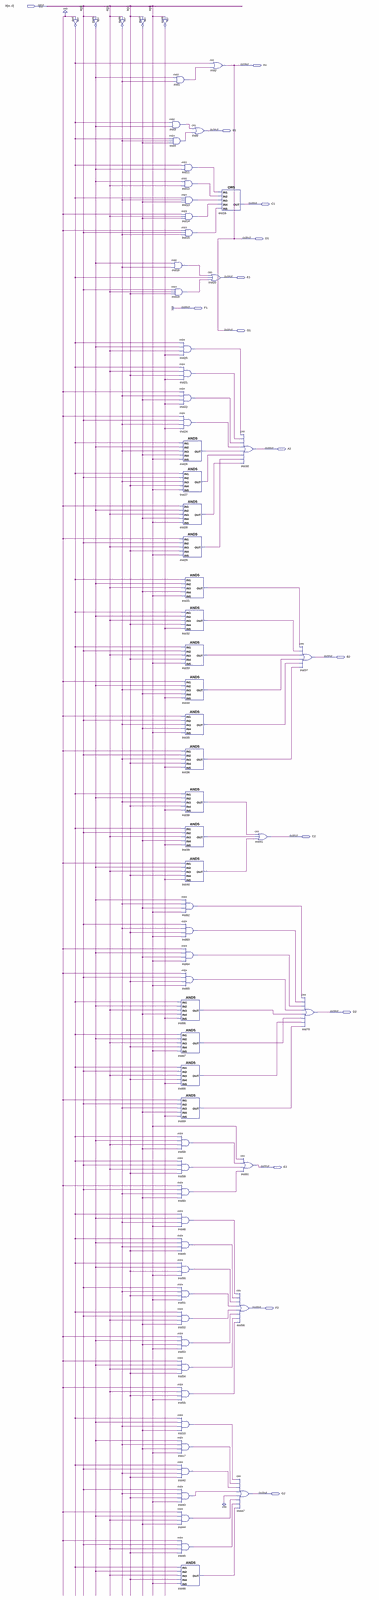
[diagram p0: schematic sheet, whole]
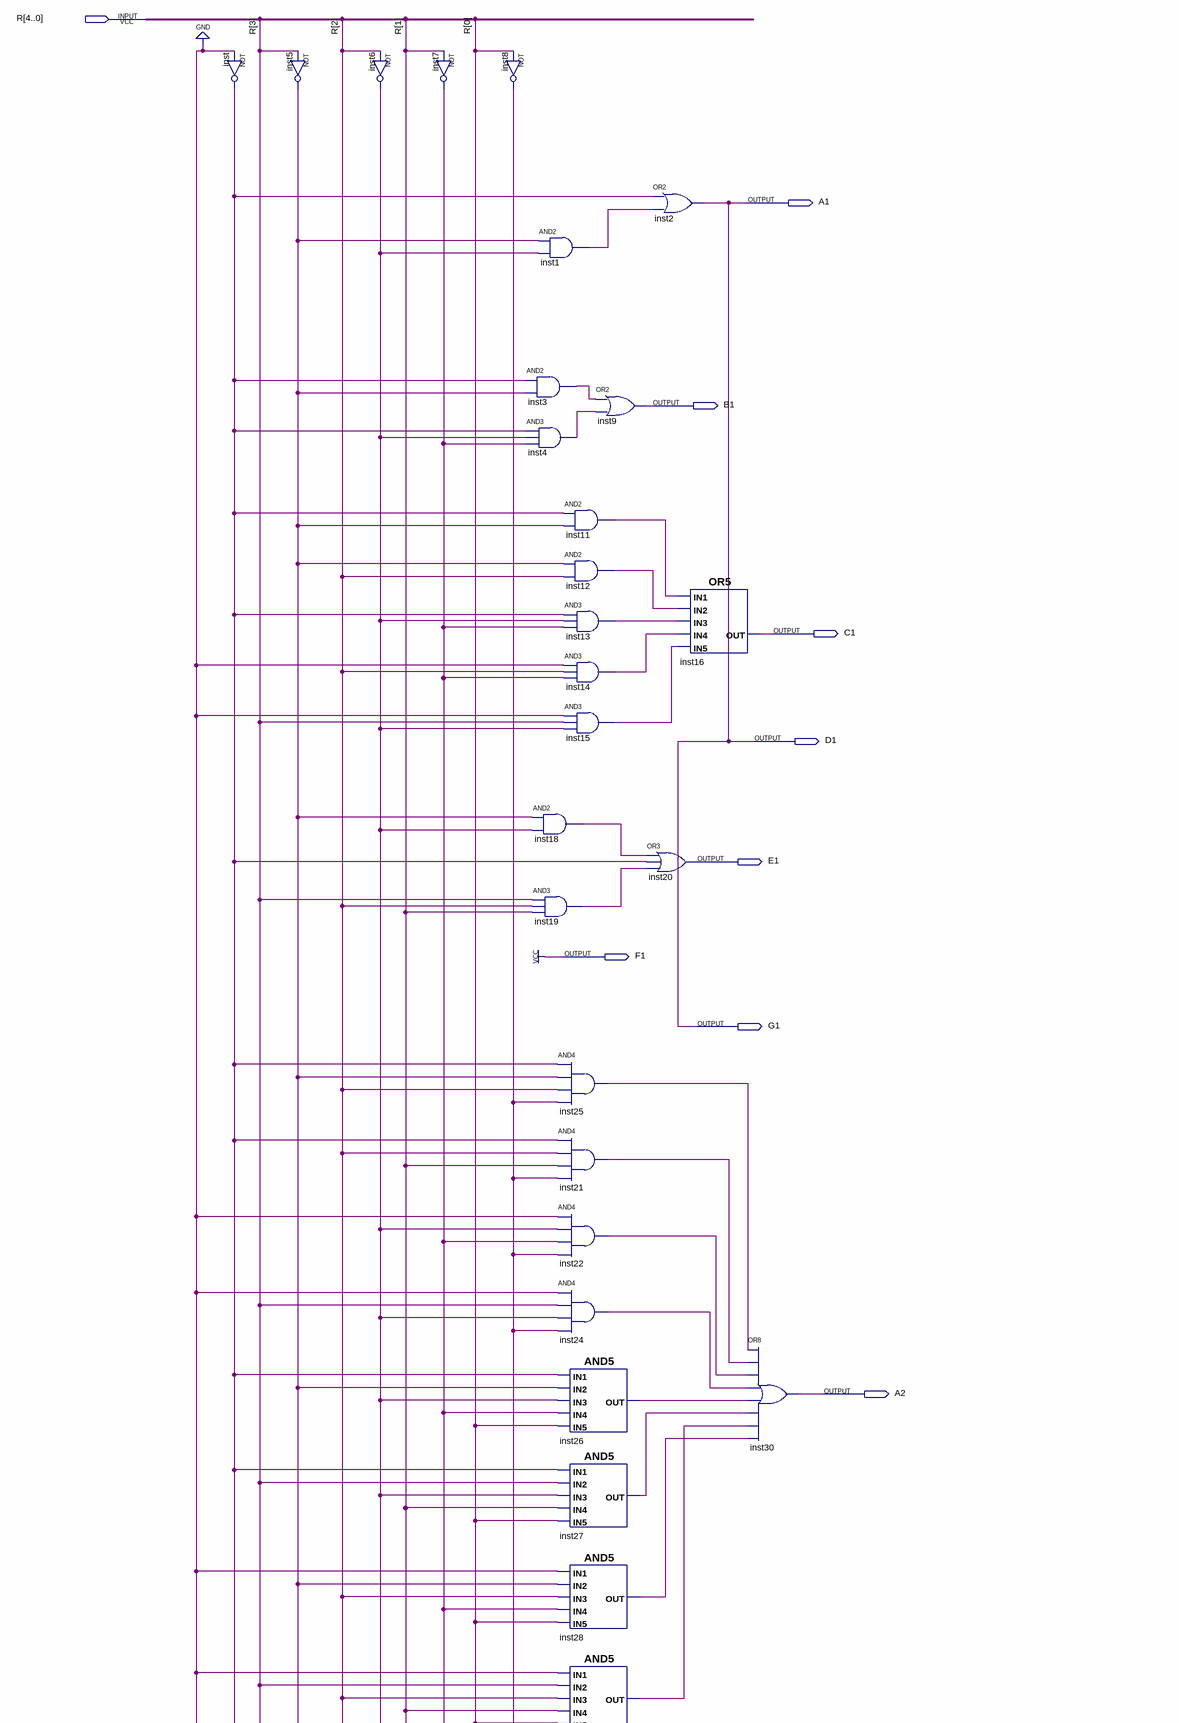
[diagram p1: schematic sheet, upper part]
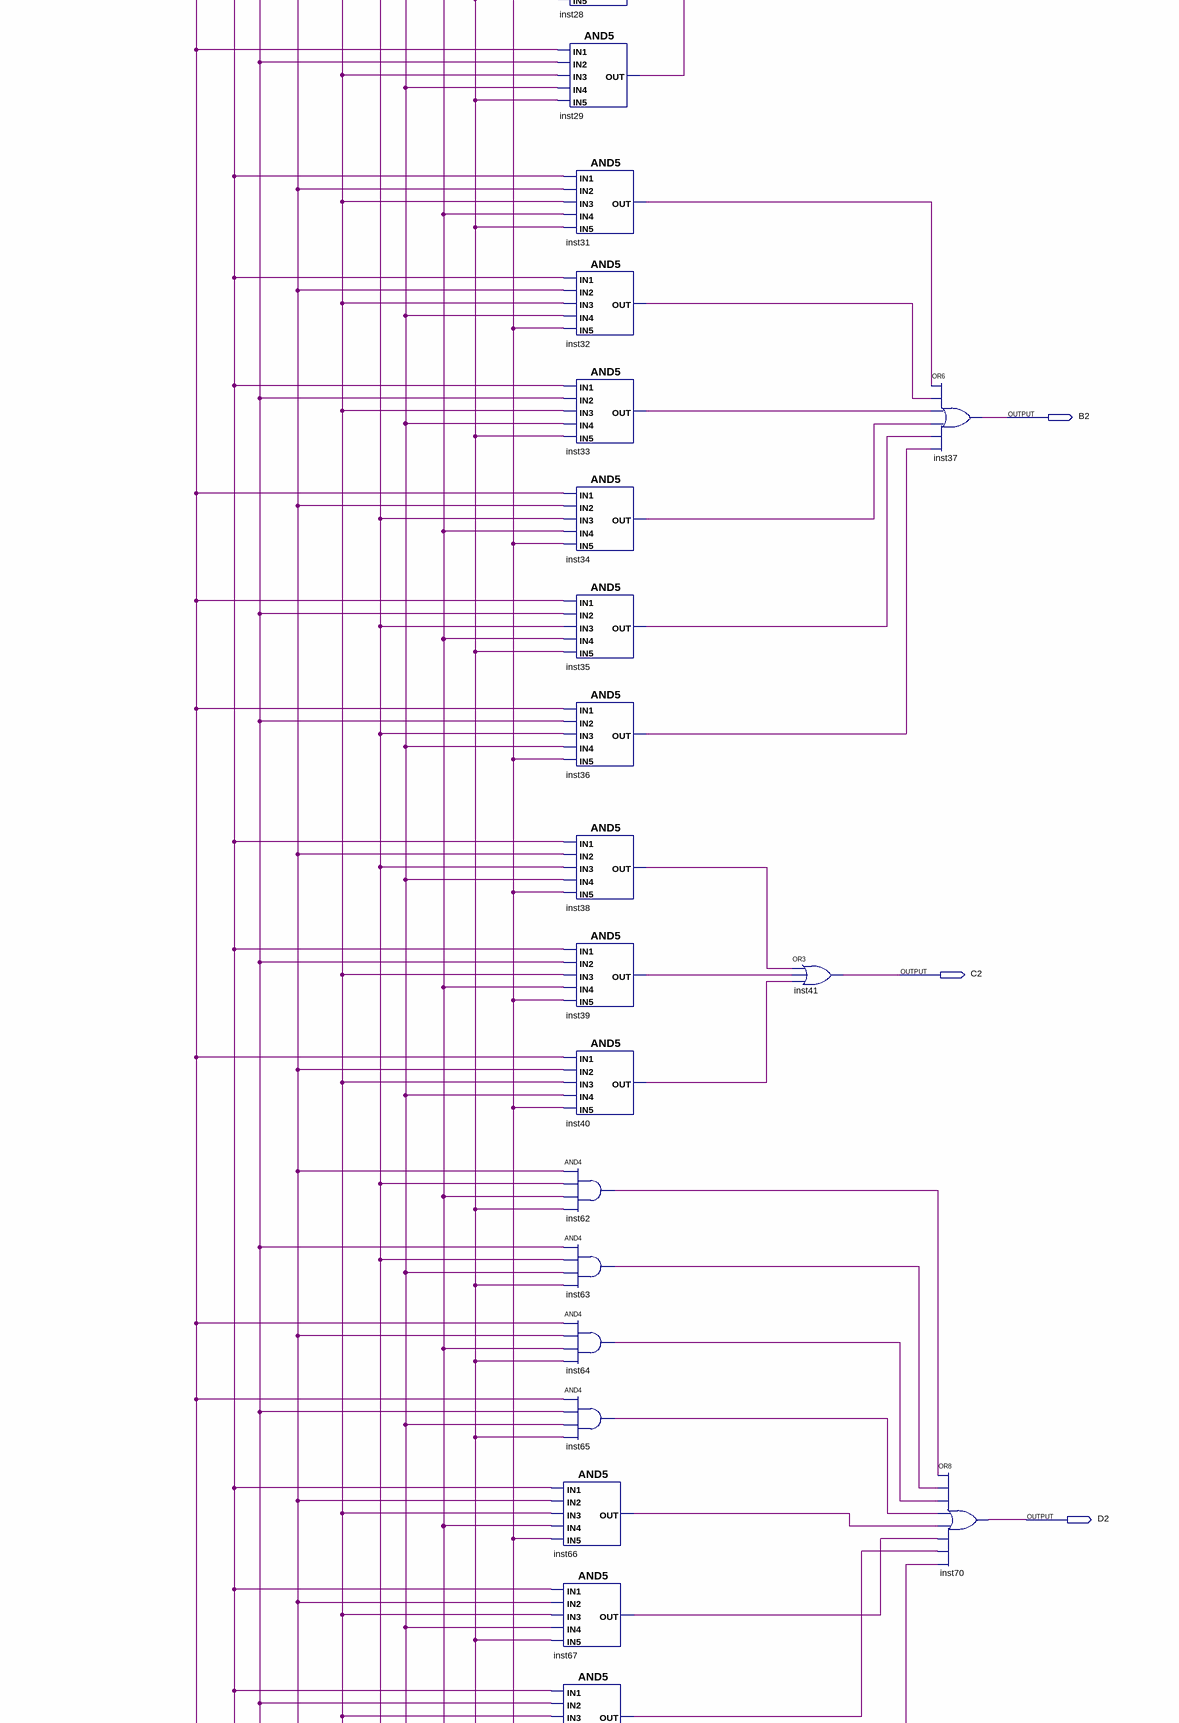
[diagram p2: schematic sheet, middle part]
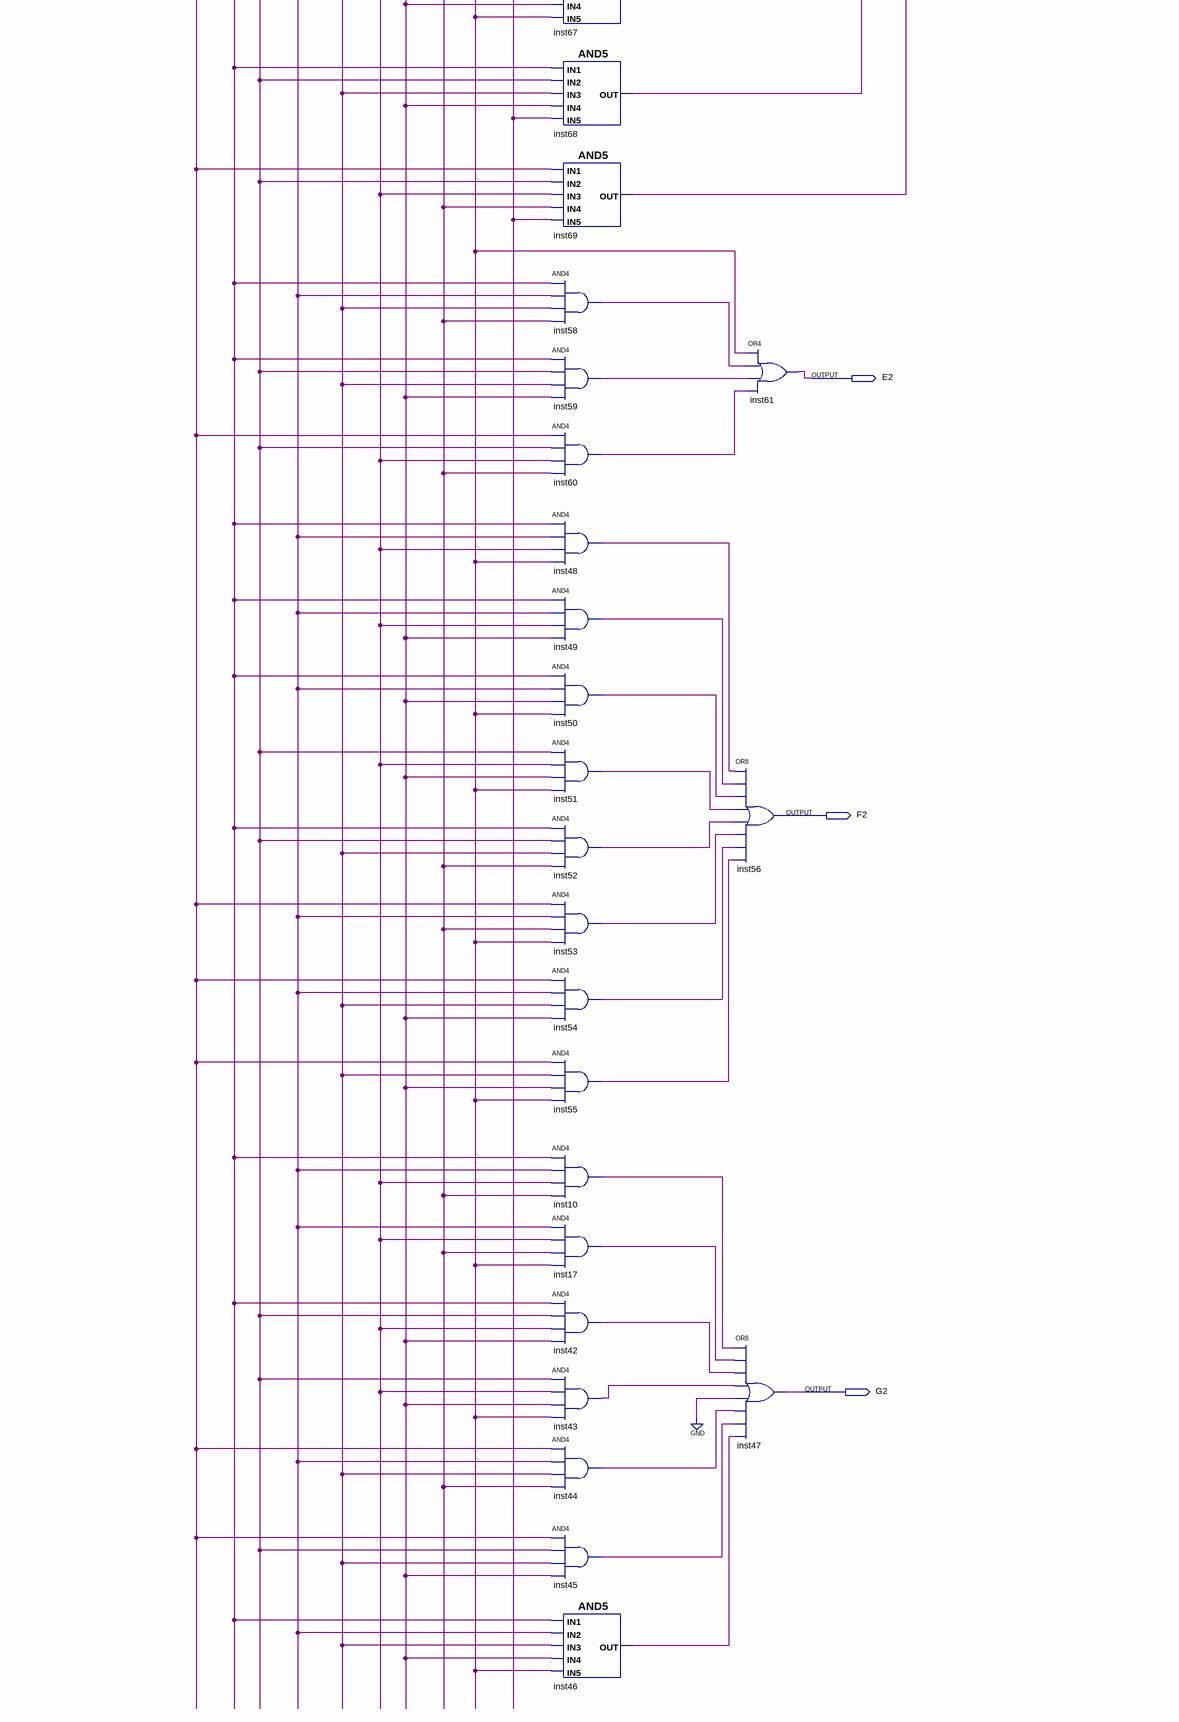
[diagram p3: schematic sheet, lower part]
// Quartus schematic DecodificadorEntrada.bdf as structural Verilog: 69 symbols, 15 pins
module DecodificadorEntrada (
  input  [4:0] R,
  output A1,
  output B1,
  output C1,
  output D1,
  output E1,
  output F1,
  output G1,
  output A2,
  output B2,
  output C2,
  output D2,
  output E2,
  output F2,
  output G2
);

  wire inst1_out, inst3_out, inst4_out, inst5_out, inst6_out, inst7_out, inst8_out, inst10_out, inst11_out,
       inst12_out, inst13_out, inst14_out, inst15_out, inst17_out, inst18_out, inst19_out, inst21_out,
       inst22_out, inst24_out, inst25_out, inst26_out, inst27_out, inst28_out, inst29_out, inst31_out,
       inst32_out, inst33_out, inst34_out, inst35_out, inst36_out, inst38_out, inst39_out, inst40_out,
       inst42_out, inst43_out, inst44_out, inst45_out, inst46_out, inst48_out, inst49_out, inst50_out,
       inst51_out, inst52_out, inst53_out, inst54_out, inst55_out, inst58_out, inst59_out, inst60_out,
       inst62_out, inst63_out, inst64_out, inst65_out, inst66_out, inst67_out, inst68_out, inst69_out,
       inst_out;

  not inst (inst_out, 1'b0);
  not inst5 (inst5_out, R[3]);
  not inst6 (inst6_out, R[2]);
  not inst7 (inst7_out, R[1]);
  not inst8 (inst8_out, R[0]);
  and inst1 (inst1_out, inst5_out, inst6_out);
  and inst3 (inst3_out, inst_out, inst5_out);
  and inst4 (inst4_out, inst_out, inst6_out, inst7_out);
  and inst18 (inst18_out, inst5_out, inst6_out);
  and inst19 (inst19_out, R[3], R[2], R[1]);
  and inst25 (inst25_out, inst_out, inst5_out, R[2], inst8_out);
  and inst21 (inst21_out, inst_out, R[2], R[1], inst8_out);
  and inst22 (inst22_out, 1'b0, inst6_out, inst7_out, inst8_out);
  and inst24 (inst24_out, 1'b0, R[3], inst6_out, inst8_out);
  and inst26 (inst26_out, inst_out, inst5_out, inst6_out, inst7_out, R[0]);
  and inst27 (inst27_out, inst_out, R[3], inst6_out, R[1], R[0]);
  and inst28 (inst28_out, 1'b0, inst5_out, R[2], inst7_out, R[0]);
  and inst29 (inst29_out, 1'b0, R[3], R[2], R[1], R[0]);
  and inst66 (inst66_out, inst_out, inst5_out, R[2], inst7_out, inst8_out);
  and inst67 (inst67_out, inst_out, inst5_out, R[2], R[1], R[0]);
  and inst68 (inst68_out, inst_out, R[3], R[2], R[1], inst8_out);
  and inst69 (inst69_out, 1'b0, R[3], inst6_out, inst7_out, inst8_out);
  and inst58 (inst58_out, inst_out, inst5_out, R[2], inst7_out);
  and inst59 (inst59_out, inst_out, R[3], R[2], R[1]);
  and inst60 (inst60_out, 1'b0, R[3], inst6_out, inst7_out);
  and inst48 (inst48_out, inst_out, inst5_out, inst6_out, R[0]);
  and inst49 (inst49_out, inst_out, inst5_out, inst6_out, R[1]);
  and inst50 (inst50_out, inst_out, inst5_out, R[1], R[0]);
  and inst51 (inst51_out, R[3], inst6_out, R[1], R[0]);
  and inst52 (inst52_out, inst_out, R[3], R[2], inst7_out);
  and inst53 (inst53_out, 1'b0, inst5_out, inst7_out, R[0]);
  and inst54 (inst54_out, 1'b0, inst5_out, R[2], R[1]);
  and inst55 (inst55_out, 1'b0, R[2], R[1], R[0]);
  and inst10 (inst10_out, inst_out, inst5_out, inst6_out, inst7_out);
  and inst17 (inst17_out, inst5_out, inst6_out, inst7_out, R[0]);
  and inst42 (inst42_out, inst_out, R[3], inst6_out, R[1]);
  and inst43 (inst43_out, R[3], inst6_out, R[1], R[0]);
  and inst44 (inst44_out, 1'b0, inst5_out, R[2], inst7_out);
  and inst45 (inst45_out, 1'b0, R[3], R[2], R[1]);
  and inst46 (inst46_out, inst_out, inst5_out, R[2], R[1], R[0]);
  or inst9 (B1, inst3_out, inst4_out);
  and inst11 (inst11_out, inst_out, inst5_out);
  and inst12 (inst12_out, inst5_out, R[2]);
  and inst13 (inst13_out, inst_out, inst6_out, inst7_out);
  and inst14 (inst14_out, 1'b0, R[2], inst7_out);
  and inst15 (inst15_out, 1'b0, R[3], inst6_out);
  and inst31 (inst31_out, inst_out, inst5_out, R[2], inst7_out, R[0]);
  and inst32 (inst32_out, inst_out, inst5_out, R[2], R[1], inst8_out);
  and inst33 (inst33_out, inst_out, R[3], R[2], R[1], R[0]);
  and inst34 (inst34_out, 1'b0, inst5_out, inst6_out, inst7_out, inst8_out);
  and inst35 (inst35_out, 1'b0, R[3], inst6_out, inst7_out, R[0]);
  and inst36 (inst36_out, 1'b0, R[3], inst6_out, R[1], inst8_out);
  and inst38 (inst38_out, inst_out, inst5_out, inst6_out, R[1], inst8_out);
  and inst39 (inst39_out, inst_out, R[3], R[2], inst7_out, inst8_out);
  and inst40 (inst40_out, 1'b0, inst5_out, R[2], R[1], inst8_out);
  and inst62 (inst62_out, inst5_out, inst6_out, inst7_out, R[0]);
  and inst63 (inst63_out, R[3], inst6_out, R[1], R[0]);
  and inst64 (inst64_out, 1'b0, inst5_out, inst7_out, R[0]);
  and inst65 (inst65_out, 1'b0, R[3], R[1], R[0]);
  or inst2 (A1, inst_out, inst1_out);
  or inst20 (E1, inst18_out, inst_out, inst19_out);
  or inst16 (C1, inst11_out, inst12_out, inst13_out, inst14_out, inst15_out);
  or inst30 (A2, inst25_out, inst21_out, inst22_out, inst24_out, inst26_out, inst27_out, inst29_out, inst28_out);
  or inst61 (E2, R[0], inst58_out, inst59_out, inst60_out);
  or inst56 (F2, inst48_out, inst49_out, inst50_out, inst51_out, inst52_out, inst53_out, inst54_out, inst55_out);
  or inst47 (G2, inst10_out, inst17_out, inst42_out, inst43_out, 1'b0, inst44_out, inst45_out, inst46_out);
  or inst41 (C2, inst38_out, inst39_out, inst40_out);
  or inst37 (B2, inst31_out, inst32_out, inst33_out, inst34_out, inst35_out, inst36_out);
  or inst70 (D2, inst62_out, inst63_out, inst64_out, inst65_out, inst66_out, inst67_out, inst68_out, inst69_out);

  assign D1 = A1;
  assign F1 = 1'b1;
  assign G1 = A1;
endmodule
